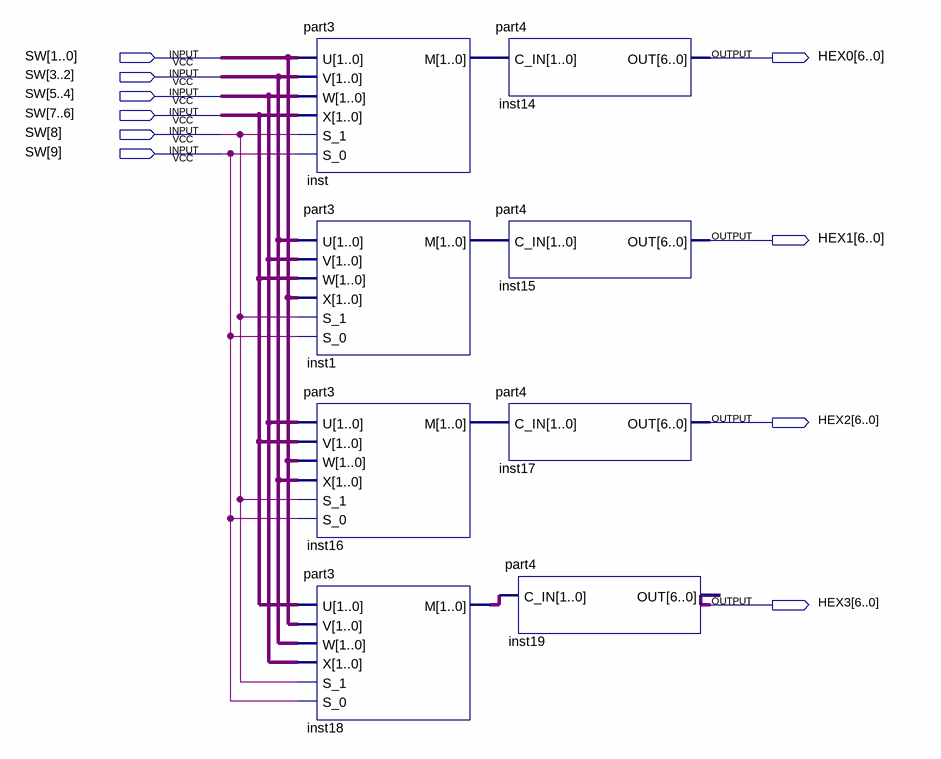
[diagram p0: schematic sheet]
// Quartus schematic part5_sch.bdf as structural Verilog: 8 symbols, 10 pins
module part5_sch (
  input  [9:0] SW,
  output [6:0] HEX0,
  output [6:0] HEX1,
  output [6:0] HEX2,
  output [6:0] HEX3
);

  wire [1:0] inst1_m, inst16_m, inst18_m, inst_m;

  part3 inst (.U(SW[1:0]), .V(SW[3:2]), .W(SW[5:4]), .X(SW[7:6]), .S_1(SW[8]), .S_0(SW[9]), .M(inst_m));
  part3 inst1 (.U(SW[3:2]), .V(SW[5:4]), .W(SW[7:6]), .X(SW[1:0]), .S_1(SW[8]), .S_0(SW[9]), .M(inst1_m));
  part3 inst16 (.U(SW[5:4]), .V(SW[7:6]), .W(SW[1:0]), .X(SW[3:2]), .S_1(SW[8]), .S_0(SW[9]), .M(inst16_m));
  part3 inst18 (.U(SW[7:6]), .V(SW[1:0]), .W(SW[3:2]), .X(SW[5:4]), .S_1(SW[8]), .S_0(SW[9]), .M(inst18_m));
  part4 inst14 (.C_IN(inst_m), .OUT(HEX0));
  part4 inst15 (.C_IN(inst1_m), .OUT(HEX1));
  part4 inst17 (.C_IN(inst16_m), .OUT(HEX2));
  part4 inst19 (.C_IN(inst18_m), .OUT(HEX3));
endmodule
